# Altium project Freezer_Controller.PrjPcb (part 2 of 2)

## Sheet Power.SchDoc
size A3; SheetNumber: 9; SheetTotal: 9
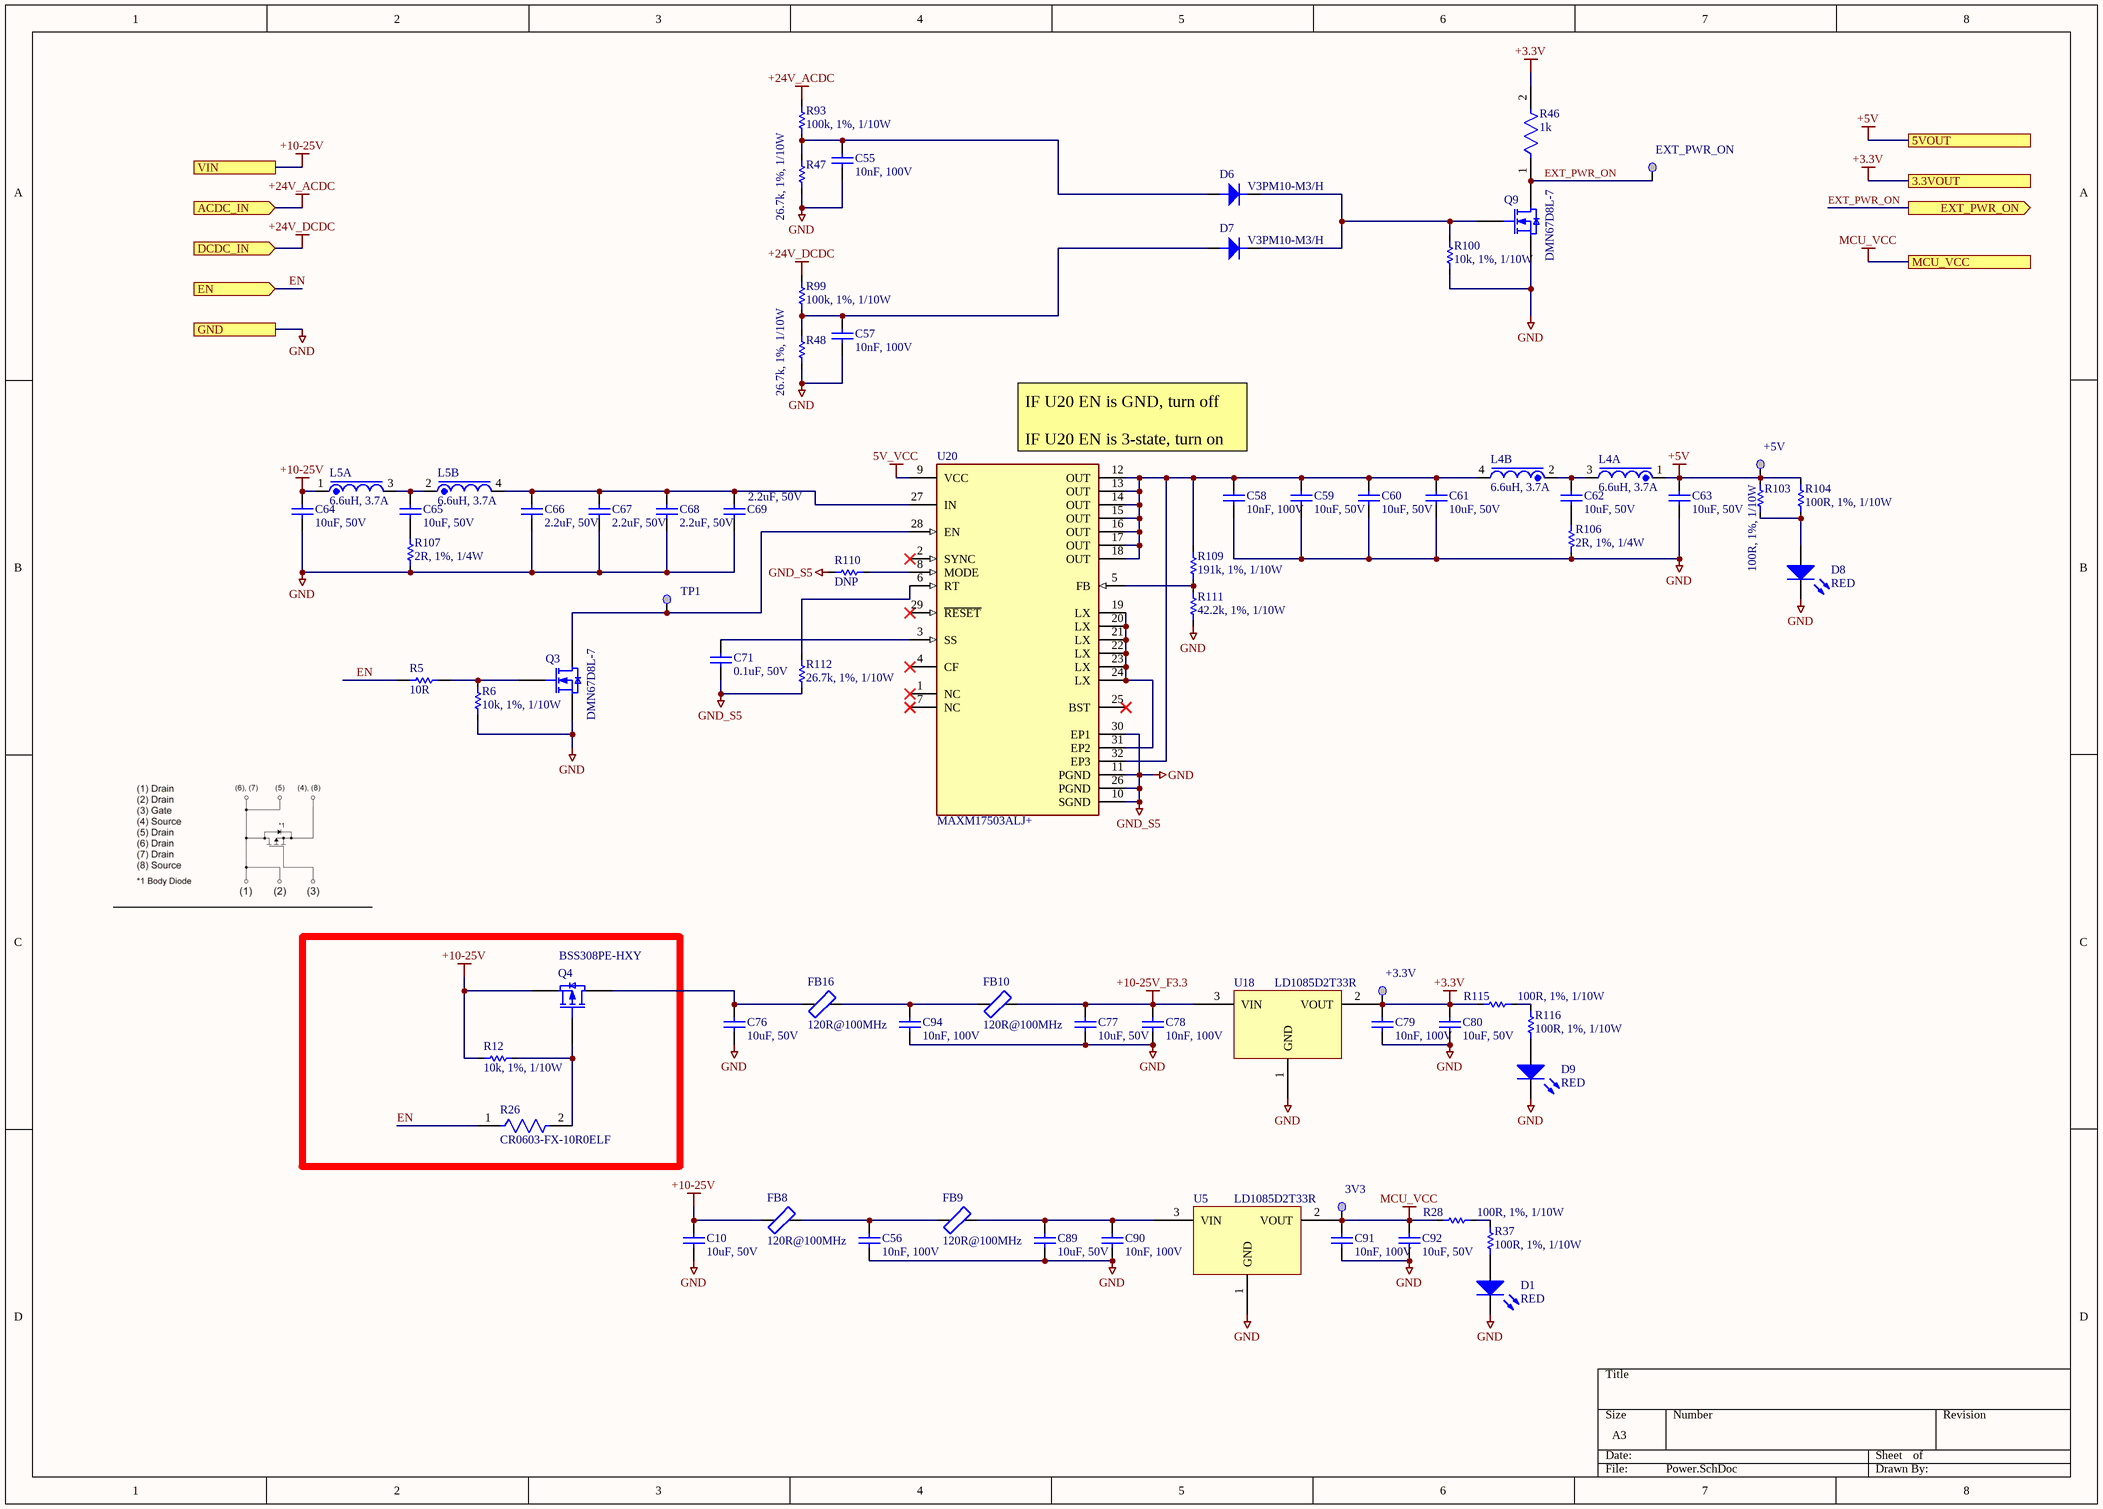
[diagram p3: Power.SchDoc]

### Parts
3V3  Test Point  [TEST POINT 40 Mil]  (value not drawn)  (no BOM)
+3.3V  Test Point  [TEST POINT 40 Mil]  (value not drawn)  (no BOM)
+5V  Test Point  [TEST POINT 40 Mil]  (value not drawn)  (no BOM)
C10  10uF, 50V  [1206]
C55  10nF, 100V  [0603]
C56  10nF, 100V  [0603]
C57  10nF, 100V  [0603]
C58  10nF, 100V  [0603]
C59  10uF, 50V  [1206]
C60  10uF, 50V  [1206]
C61  10uF, 50V  [1206]
C62  10uF, 50V  [1206]
C63  10uF, 50V  [1206]
C64  10uF, 50V  [1206]
C65  10uF, 50V  [1206]
C66  2.2uF, 50V  [1206]
C67  2.2uF, 50V  [1206]
C68  2.2uF, 50V  [1206]
C69  2.2uF, 50V  [1206]
C71  0.1uF, 50V  [0805]
C76  10uF, 50V  [1206]
C77  10uF, 50V  [1206]
C78  10nF, 100V  [0603]
C79  10nF, 100V  [0603]
C80  10uF, 50V  [1206]
C89  10uF, 50V  [1206]
C90  10nF, 100V  [0603]
C91  10nF, 100V  [0603]
C92  10uF, 50V  [1206]
C94  10nF, 100V  [0603]
D1  RED  [0603D]
D6  V3PM10-M3/H  [SMP]
D7  V3PM10-M3/H  [SMP]
D8  RED  [0603_DIODE_K1A2]
D9  RED  [0603_DIODE_K1A2]
EXT_PWR_ON  Test Point  [TEST POINT 40 Mil]  (value not drawn)  (no BOM)
FB8  120R@100MHz  [1206]
FB9  120R@100MHz  [1206]
FB10  120R@100MHz  [1206]
FB16  120R@100MHz  [1206]
L4  6.6uH, 3.7A  [PLCC300P1250X1250X600-4N]  (parts A,B of 2)
L5  6.6uH, 3.7A  [PLCC300P1250X1250X600-4N]  (parts A,B of 2)
Q3  DMN67D8L-7  [SOT23-3]
Q4  BSS308PE-HXY  [SOT-23]
Q9  DMN67D8L-7  [SOT23-3]
R5  10R  [RESC1608X55X25NL10T15]
R6  10k, 1%, 1/10W  [0603]
R12  10k, 1%, 1/10W  [0603]
R26  CR0603-FX-10R0ELF  [FP-CR0603-MFG]
R28  100R, 1%, 1/10W  [0603]
R37  100R, 1%, 1/10W  [0603]
R46  1k  [FP-MCT0603-MFG]
R47  26.7k, 1%, 1/10W  [0603]
R48  26.7k, 1%, 1/10W  [0603]
R93  100k, 1%, 1/10W  [0603]
R99  100k, 1%, 1/10W  [0603]
R100  10k, 1%, 1/10W  [0603]
R103  100R, 1%, 1/10W  [0603]
R104  100R, 1%, 1/10W  [0603]
R106  2R, 1%, 1/4W  [1206]
R107  2R, 1%, 1/4W  [1206]
R109  191k, 1%, 1/10W  [0603]
R110  DNP  [0603]
R111  42.2k, 1%, 1/10W  [0603]
R112  26.7k, 1%, 1/10W  [0603]
R115  100R, 1%, 1/10W  [0603]
R116  100R, 1%, 1/10W  [0603]
TP1  Test Point  [TEST POINT 40 Mil]  (value not drawn)  (no BOM)
U5  LD1085D2T33R  [D2PAK]
U18  LD1085D2T33R  [D2PAK]
U20  MAXM17503ALJ+  [FP-L32915-3-MFG]

### Ports
3.3VOUT, 5VOUT, ACDC_IN (in), DCDC_IN (in), EN (in), EXT_PWR_ON (out), GND, MCU_VCC, VIN

### Nets
5V_VCC: U20.9(VCC)
+3.3V: 3V3.1 +3.3V.1 C79.2 C80.2 C91.2 C92.2 R28.2 R46.2 R115.2 U5.2(VOUT) U18.2(VOUT) ; port 3.3VOUT, port MCU_VCC  [also labelled MCU_VCC]
+5V: +5V.1 C63.2 L4.1 R103.2 R104.2 ; port 5VOUT
+10-25V: C10.2 C64.2 FB8.1 L5.1 Q4.3(S) R12.1 ; port VIN
+10-25V_F3.3: C77.2 C78.2 FB10.2 U18.3(VIN)
+24V_ACDC: R93.1 ; port ACDC_IN  [project net ACDC_VS]
+24V_DCDC: R99.1 ; port DCDC_IN  [project net DCDC_VS]
GND: C10.1 C55.1 C56.1 C57.1 C58.1 C59.1 C60.1 C61.1 C63.1 C64.1 C66.1 C67.1 C68.1 C69.1 C71.1 C76.1 C77.1 C78.1 C79.1 C80.1 C89.1 C90.1 C91.1 C92.1 C94.1 D1.2(K) D8.2(K) D9.2(K) Q3.2(S) Q9.2(S) R6.2 R47.1 R48.1 R100.2 R106.1 R107.1 R110.1 R111.1 R112.1 U5.1(GND) U18.1(GND) U20.10(SGND) U20.11(PGND) U20.26(PGND) U20.30(EP1) ; port GND  [also labelled GND_S5]
EN: R5.1 R26.1 ; port EN
EXT_PWR_ON: EXT_PWR_ON.1 Q9.3(D) R46.1 ; port EXT_PWR_ON
NetC55_2: C55.2 D6.1(A) R47.2 R93.2
NetC56_2: C56.2 FB8.2 FB9.1
NetC57_2: C57.2 D7.1(A) R48.2 R99.2
NetC58_2: C58.2 C59.2 C60.2 C61.2 L4.4 R109.2 U20.12(OUT) U20.13(OUT) U20.14(OUT) U20.15(OUT) U20.16(OUT) U20.17(OUT) U20.18(OUT) U20.32(EP3)
NetC62_1: C62.1 R106.2
NetC62_2: C62.2 L4.2 L4.3
NetC65_1: C65.1 R107.2
NetC65_2: C65.2 L5.2 L5.3
NetC66_2: C66.2 C67.2 C68.2 C69.2 L5.4 U20.27(IN)
NetC71_2: C71.2 U20.3(SS)
NetC76_2: C76.2 FB16.1 Q4.2(D)
NetC89_2: C89.2 C90.2 FB9.2 U5.3(VIN)
NetC94_2: C94.2 FB10.1 FB16.2
NetD1_1: D1.1(A) R37.2
NetD6_2: D6.2(K) D7.2(K) Q9.1(G) R100.1
NetD8_1: D8.1(A) R103.1 R104.1
NetD9_1: D9.1(A) R116.2
NetQ3_1: Q3.1(G) R5.2 R6.1
NetQ3_3: Q3.3(D) TP1.1 U20.28(EN)
NetQ4_1: Q4.1(G) R12.2 R26.2
NetR28_1: R28.1 R37.1
NetR109_1: R109.1 R111.2 U20.5(FB)
NetR110_2: R110.2 U20.8(MODE)
NetR112_2: R112.2 U20.6(RT)
NetR115_1: R115.1 R116.1
NetU20_19: U20.19(LX) U20.20(LX) U20.21(LX) U20.22(LX) U20.23(LX) U20.24(LX) U20.31(EP2)

Not connected (* = marked no-connect by the designer): U20 1(NC)* 2(SYNC)* 4(CF)* 7(NC)* 25(BST)* 29(~{RESET})*

### Notes on the sheet
- IF U20 EN is GND, turn off
  IF U20 EN is 3-state, turn on

### Library data of the parts
3V3 +3.3V +5V EXT_PWR_ON TP1 = Test Point: Test Point 0.3mm; PartType: Mechanical; ComponentLink1Description: Datasheet
C10 C59-C65 C76 C77 C80 C89 C92 = NS00832: CAP CER 10UF 50V X7R 1206; Type: C; Alternatives: Generic; Part Number: NS00832; Value: 10uF, 50V; Supplier 1: Digi-Key; Supplier Part Number 1: 1276-6767-1-ND
C55-C58 C78 C79 C90 C91 C94 = NS00848: CAP CER 10000PF 100V C0G 0603; Type: C; Alternatives: Generic; Part Number: NS00848; Value: 10nF, 100V; Supplier 1: Digi-Key; Supplier Part Number 1: 445-172665-1-ND
C66-C69 = NS00824: CAP CER 2.2UF 50V X7R 1206; Type: C; Alternatives: Generic; Part Number: NS00824; Value: 2.2uF, 50V; Supplier 1: Digi-Key; Supplier Part Number 1: 1276-3137-1-ND
C71 = NS00353: 0.10µF ±10% 50V Ceramic Capacitor X7R 0805 (2012 Metric); Type: C; Alternatives: Generic; Part Number: NS00353; Value: 0.1uF, 50V; Supplier 1: Digi-Key; Supplier Part Number 1: 478-1395-1-ND
D1 D8 D9 = NS00945: LED RED CLEAR 1608 SMD; Type: IC; Part Number: NS00945; Value: RED; ComponentLink1Description: Datasheet; ComponentLink1URL: H:\Doc\Harvatek\B1911USD-20D000114U1930.pdf; Supplier 1: Digi-Key; Supplier Part Number 1: 3147-B1911USD-20D000114U1930CT-ND
D6 D7 = NS00857: SCHOTTKY RECTIFIER 3A 100V SMP; Part Number: NS00857; Type: Diode; Value: V3PM10-M3/H; ComponentLink1Description: Datasheet; ComponentLink1URL: H:\Doc\Vishay\v3pm10.pdf; Supplier 1: Digi-Key; Supplier Part Number 1: 112-V3PM10-M3/HCT-ND
FB8-FB10 FB16 = NS00883: FERRITE BEAD 120 OHM 1206 1LN; Type: Inductor; Part Number: NS00883; Value: 120R@100MHz; ComponentLink1Description: Datasheet; ComponentLink1URL: H:\Doc\Murata\QNFA9148.pdf; Supplier 1: Digi-Key; Supplier Part Number 1: 490-16523-1-ND
L4 L5 = NS00831: INDUCT ARRAY 2 COIL 6.6UH SMD; Type: Inductor; Part Number: NS00831; Value: 6.6uH, 3.7A; ComponentLink1Description: Datasheet; ComponentLink1URL: H:\Doc\pulse\SPM2007_28.pdf; Supplier 1: Digi-Key; Supplier Part Number 1: 553-3631-ND
Q3 Q9 = NS00873: MOSFET N-CH 60V 210MA SOT23; Type: IC; Published: 8-Jun-2000; LatestRevisionDate: 17-Jul-2002; LatestRevisionNote: Re-released for DXP Platform.; PackageVersion: 1995/1996; PackageReference: E3; Publisher: Altium Limited; Part Number: NS00873; Value: DMN67D8L-7; ComponentLink1Description: Datasheet; ComponentLink1URL: H:\Doc\Diodes\DMN67D8L.pdf; Supplier 1: Digi-Key; Supplier Part Number 1: DMN67D8L-7DICT-ND
Q4 = NS00810: P-CHANNEL MOSFET, / BSS308PE-HXY; Type: IC; Part Number: NS00810; Value: BSS308PE-HXY; ComponentLink1Description: Datasheet; ComponentLink1URL: H:\Doc\MicroCommercial\MCU45P03A(DPAK).pdf; Supplier 1: Digi-Key; Supplier Part Number 1: 353-MCU45P03A-TPCT-ND
R5 = CMP-1659-00008-4: Chip Resistor, 10 Ohm, +/- 1%, 0.1 W, -55 to 155 degC, 0603 (1608 Metric), RoHS, Tape and Reel; Manufacturer: Yageo; Voltage Rating: 50 V; PackageReference: 0603; ComponentLink3Description: Package Specification; Packaging: Tape and Reel; Max Operating Temperature: 155 degC; ComponentLink3URL: http://www.farnell.com/datasheets/443971.pdf; PackageDescription: 2-Pin Surface Mount Device, Body 1.6 x 0.8 mm; ComponentLink1URL: http://www.yageo.com/; Pins: 2; REACH SVHC: No SVHC; RoHSCompliant: true; ComponentLink2URL: http://www.yageo.com/documents/recent/PYu-RC_Group_51_RoHS_L_04.pdf; DatasheetVersion: Rev. 4, 02/2016; Mount: Surface Mount; Package Quantity: 200; Min Operating Temperature: -55 degC; Height: 0.45 mm; Mounting Technology: Surface Mount; ComponentLink1Description: Manufacturer URL; ComponentLink2Description: Datasheet; Length: 1.6 mm; Supplier 1: Digi-Key; Supplier Part Number 1: 311-10.0HRTR-ND
R6 R12 R100 = NS00820: RES 10K OHM 1% 1/10W 0603; Alternatives: Generic; Part Number: NS00820; Type: R; Value: 10k, 1%, 1/10W; Supplier 1: Digi-Key; Supplier Part Number 1: RMCF0603FT10K0CT-ND
R26 = CMP-1012-00284-2: Thick Film Chip Resistors 0603 10Ω 0.1W 1% 100ppm/°C; Max Power Dissipation: 100mW; Resistance: 10R; Voltage Rating: 50V; Depth: 0.8mm; REACH SVHC: No SVHC; Package Quantity: 1; Thickness: 457um; Length: 1.6mm; Tolerance: 1%; Width: 0.8mm; Number of Pins: 2; Height: 0.45mm; Military Standard: Not; Features: Moisture Resistant; Packaging: Tape and Reel; Case/Package: 0603; Power Rating: 100mW; Voltage Rating (DC): 50V; Radiation Hardening: No; Mount: Surface Mount; Min Operating Temperature: -55°C; Composition: Thick Film; Max Operating Temperature: 155°C; Termination: SMD/SMT; Temperature Coefficient: 100ppm/°C; Case Code (Imperial): 0603; Case Code (Metric): 1608; Number of Terminations: 2; Contact Plating: Tin
R28 R37 R103 R104 R115 R116 = NS00870: RES 100 OHM 1% 1/10W 0603; Alternatives: Generic; Part Number: NS00870; Type: R; Value: 100R, 1%, 1/10W; Supplier 1: Digi-Key; Supplier Part Number 1: RMCF0603FT100RCT-ND
R46 = CMP-02407-007689-1: RES SMD 1kOHM 1% 1/8W 0603; Power Rating: 125mW; Voltage Rating: 75V; Resistance: 150R; Temperature Coefficient: 25ppm/°C; Tolerance: 0.1%; Length: 0.061inch; Composition: Thin Film; Weight: 7.1E-05oz; Case Code (Imperial): 0603; Voltage Rating (DC): 75V; Termination: SMD/SMT; Max Power Dissipation: 125mW; Case Code (Metric): 1608; Package Quantity: 1; Height: 0.45mm; Radiation Hardening: No; Width: 0.033inch; Max Operating Temperature: 155°C; Case/Package: 0603; Features: Automotive AEC-Q200; Contact Plating: Tin; Packaging: Tape and Reel; Number of Pins: 2; Number of Terminations: 2; REACH SVHC: No SVHC; Depth: 0.85mm; Min Operating Temperature: -55°C; Supplier 1: Digi-Key; Supplier Part Number 1: 311-1.0KGRTR-ND
R47 R48 R112 = NS00823: RES 26.7K OHM 1% 1/10W 0603; Alternatives: Generic; Part Number: NS00823; Type: R; Value: 26.7k, 1%, 1/10W; Supplier 1: Digi-Key; Supplier Part Number 1: RMCF0603FT26K7
R93 R99 = NS00835: RES 100K OHM 1% 1/10W 0603; Alternatives: Generic; Part Number: NS00835; Type: R; Value: 100k, 1%, 1/10W; Supplier 1: Digi-Key; Supplier Part Number 1: RMCF0603FT100KCT-ND
R106 R107 = NS00946: RES 2 OHM 1% 1/4W 1206; Alternatives: Generic; Part Number: NS00946; Type: R; Value: 2R, 1%, 1/4W; Supplier 1: Digi-Key; Supplier Part Number 1: 738-RMCF1206FT2R00CT-ND
R109 = NS00821: RES 191K OHM 1% 1/10W 0603; Alternatives: Generic; Part Number: NS00821; Type: R; Value: 191k, 1%, 1/10W; Supplier 1: Digi-Key; Supplier Part Number 1: RMCF0603FT191KCT-ND
R110 = NS00876: RES 0 OHM JUMPER 1/10W 0603; Value: 0R, 1/10W; Alternatives: Generic; Part Number: NS00876; Type: R; Supplier 1: Digi-Key; Supplier Part Number 1: RMCF0603ZT0R00CT-ND
R111 = NS00822: RES 42.2K OHM 1% 1/10W 0603; Alternatives: Generic; Part Number: NS00822; Type: R; Value: 42.2k, 1%, 1/10W; Supplier 1: Digi-Key; Supplier Part Number 1: RMCF0603FT42K2
U5 U18 = NS00880: IC REG LINEAR 3.3V 3A D2PAK; Part Number: NS00880; Type: IC; Value: LD1085D2T33R; ComponentLink1Description: Datasheet; ComponentLink1URL: H:\Doc\ST\en.CD00001883.pdf; Supplier 1: Digi-Key; Supplier Part Number 1: 497-1222-1-ND
U20 = CMP-05722-000278-1: DC DC CONVERTER 0.9-12V; Output Voltage: 12V; Min Output Voltage: 900mV; Max Input Voltage: 60V; Number of Outputs: 1; Max Output Current: 2.5A; Min Input Voltage: 4.5V; Switching Frequency: 1.8MHz; Voltage - Output 1: 12V; Length: 0.59inch; Mount: Surface Mount; Max Operating Temperature: 125°C; Height: 0.11inch; Width: 0.35inch; Number of Pins: 29; Max Output Voltage: 12V; RoHS Compliant: Yes; Series: Himalaya; Min Operating Temperature: -40°C; Features: UVLO; Packaging: Rail/Tube; Output Current: 2.5A; Case/Package: SMD/SMT; Supplier 1: Digi-Key; Supplier Part Number 1: MAXM17503ALJ+-ND

## Sheet RTDIface.SchDoc
size A; SheetNumber: 7; SheetTotal: 10
Used 6 times, as channels U_RTDIface1, U_RTDIface2, U_RTDIface3, U_RTDIface4, U_RTDIface5, U_RTDIface6. Parts and nets are listed once, with the designators drawn on the sheet.
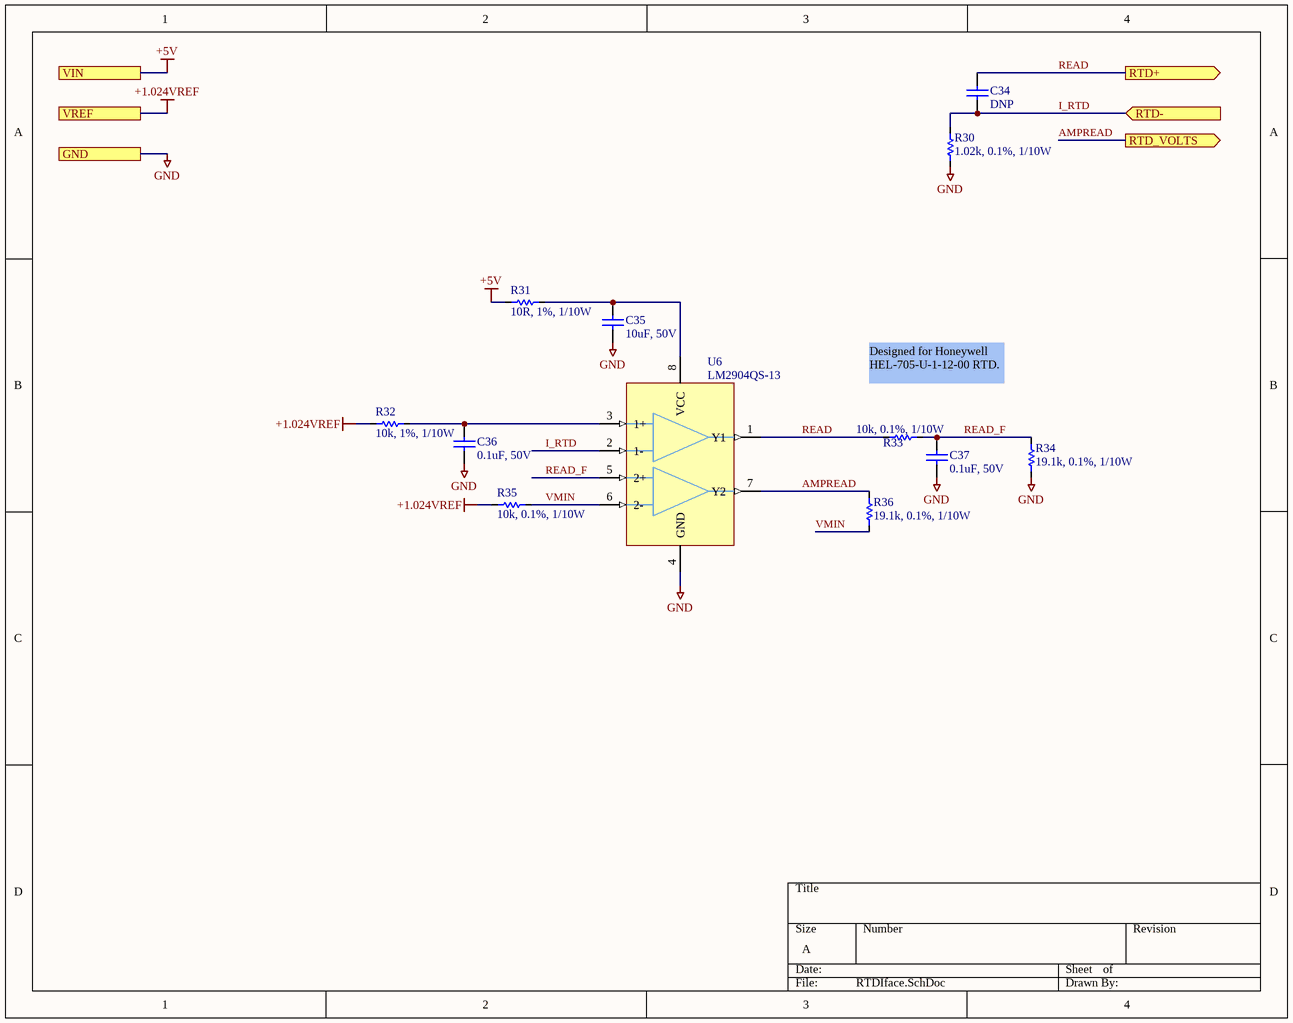
[diagram p4: RTDIface.SchDoc]

### Parts
C34  DNP  [0603]
C35  10uF, 50V  [1206]
C36  0.1uF, 50V  [0805]
C37  0.1uF, 50V  [0805]
R30  1.02k, 0.1%, 1/10W  [0603]
R31  10R, 1%, 1/10W  [0603]
R32  10k, 1%, 1/10W  [0603]
R33  10k, 0.1%, 1/10W  [0603]
R34  19.1k, 0.1%, 1/10W  [0603]
R35  10k, 0.1%, 1/10W  [0603]
R36  19.1k, 0.1%, 1/10W  [0603]
U6  LM2904QS-13  [SOIC127P600X163-8N]

### Ports
GND, RTD+ (out), RTD- (in), RTD_VOLTS (out), VIN, VREF

### Nets
+1.024VREF: R32.2 R35.1 ; port VREF
+5V: R31.1 ; port VIN
GND: C35.1 C36.1 C37.1 R30.1 R34.1 U6.4(GND) ; port GND
AMPREAD: R36.2 U6.7(Y2) ; port RTD_VOLTS
I_RTD: C34.2 R30.2 U6.2(1-) ; port RTD-
READ: C34.1 R33.1 U6.1(Y1) ; port RTD+
READ_F: C37.2 R33.2 R34.2 U6.5(2+)
VMIN: R35.2 R36.1 U6.6(2-)
NetC35_2: C35.2 R31.2 U6.8(VCC)
NetC36_2: C36.2 R32.1 U6.3(1+)

### Channels
U_RTDIface1: designators end in _1; ports GND=GND RTD+=READ RTD-=I_RTD RTD_VOLTS=AMPREAD VIN=+5V VREF=VREF
U_RTDIface2: designators end in _2; ports GND=GND RTD+=READ RTD-=I_RTD RTD_VOLTS=AMPREAD VIN=+5V VREF=VREF
U_RTDIface3: designators end in _3; ports GND=GND RTD+=READ RTD-=I_RTD RTD_VOLTS=AMPREAD VIN=+5V VREF=VREF
U_RTDIface4: designators end in _4; ports GND=GND RTD+=READ RTD-=I_RTD RTD_VOLTS=AMPREAD VIN=+5V VREF=VREF
U_RTDIface5: designators end in _5; ports GND=GND RTD+=READ RTD-=I_RTD RTD_VOLTS=AMPREAD VIN=+5V VREF=VREF
U_RTDIface6: designators end in _6; ports GND=GND RTD+=READ RTD-=I_RTD RTD_VOLTS=AMPREAD VIN=+5V VREF=VREF

### Notes on the sheet
- Designed for Honeywell HEL-705-U-1-12-00 RTD.

### Library data of the parts
C34 = NS00848: CAP CER 10000PF 100V C0G 0603; Type: C; Value: 10nF, 100V; Alternatives: Generic; Part Number: NS00848; Supplier 1: Digi-Key; Supplier Part Number 1: 445-172665-1-ND
C35 = NS00832: as C10 on sheet Power; Part Number: NS00832; Value: 10uF, 50V; Supplier 1: Digi-Key; Supplier Part Number 1: 1276-6767-1-ND
C36 C37 = NS00353: as C71 on sheet Power; Part Number: NS00353; Value: 0.1uF, 50V; Supplier 1: Digi-Key; Supplier Part Number 1: 478-1395-1-ND
R30 = NS00884: RES SMD 1.02KOHM 0.1% 1/10W 0603; Alternatives: Generic; Part Number: NS00884; Type: R; Value: 1.02k, 0.1%, 1/10W; Supplier 1: Digi-Key; Supplier Part Number 1: YAG2308CT-ND
R31 = NS00796: RES 10 OHM 1% 1/10W 0603; Alternatives: Generic; Part Number: NS00796; Type: R; Value: 10R, 1%, 1/10W; Supplier 1: Digi-Key; Supplier Part Number 1: 1292-WR06X10R0FTLCT-ND
R32 = NS00820: as R6 on sheet Power; Part Number: NS00820; Type: R; Value: 10k, 1%, 1/10W; Supplier 1: Digi-Key; Supplier Part Number 1: RMCF0603FT10K0CT-ND
R33 R35 = NS00885: RES SMD 10K OHM 0.1% 1/10W 0603; Alternatives: Generic; Part Number: NS00885; Type: R; Value: 10k, 0.1%, 1/10W; Supplier 1: Digi-Key; Supplier Part Number 1: YAG1236CT-ND
R34 R36 = NS00886: RES SMD 19.1KOHM 0.1% 1/10W 0603; Alternatives: Generic; Part Number: NS00886; Type: R; Value: 19.1k, 0.1%, 1/10W; Supplier 1: Digi-Key; Supplier Part Number 1: YAG1555CT-ND
U6 = NS00864: IC OPAMP GP 2 CIRCUIT 8SO; Part Number: NS00864; Type: IC; Value: LM2904QS-13; ComponentLink1Description: Datasheet; ComponentLink1URL: H:\Doc\Diodes\LM2902Q-04Q.pdf; Supplier 1: Digi-Key; Supplier Part Number 1: LM2904QS-13DICT-ND

## Sheet DisplayIface.SchDoc
size A; SheetNumber: 3; SheetTotal: 9
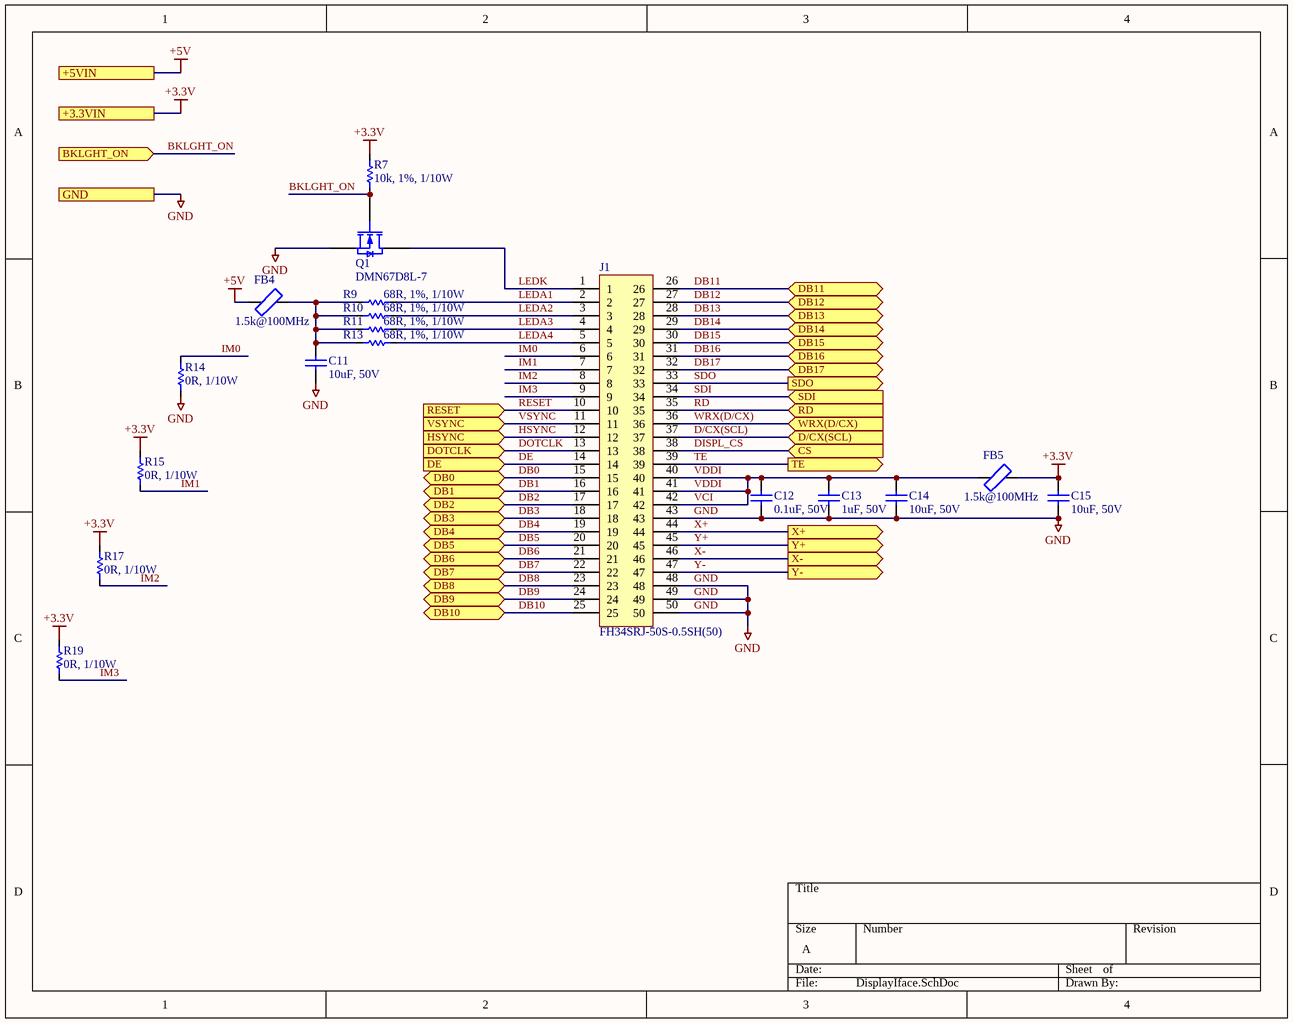
[diagram p5: DisplayIface.SchDoc]

### Parts
C11  10uF, 50V  [1206]
C12  0.1uF, 50V  [0805]
C13  1uF, 50V  [0805]
C14  10uF, 50V  [1206]
C15  10uF, 50V  [1206]
FB4  1.5k@100MHz  [0805]
FB5  1.5k@100MHz  [0805]
J1  FH34SRJ-50S-0.5SH(50)  [CONN_HIROSE_FH34SRJ-50S-0.5SH(50)]
Q1  DMN67D8L-7  [SOT23-3]
R7  10k, 1%, 1/10W  [0603]
R9  68R, 1%, 1/10W  [0603]
R10  68R, 1%, 1/10W  [0603]
R11  68R, 1%, 1/10W  [0603]
R13  68R, 1%, 1/10W  [0603]
R14  0R, 1/10W  [0603]
R15  0R, 1/10W  [0603]
R17  0R, 1/10W  [0603]
R19  0R, 1/10W  [0603]

### Ports
+3.3VIN, +5VIN, BKLGHT_ON (in), CS (in), D/CX(SCL) (in), DB0 (bidir), DB1 (bidir), DB2 (bidir), DB3 (bidir), DB4 (bidir), DB5 (bidir), DB6 (bidir), DB7 (bidir), DB8 (bidir), DB9 (bidir), DB10 (bidir), DB11 (bidir), DB12 (bidir), DB13 (bidir), DB14 (bidir), DB15 (bidir), DB16 (bidir), DB17 (bidir), DE (in), DOTCLK (in), GND, HSYNC (in), RD (in), RESET (in), SDI (in), SDO (out), TE (out), VSYNC (in), WRX(D/CX) (in), X+ (out), X- (out), Y+ (out), Y- (out)

### Nets
+3.3V: C15.2 FB5.1 R7.2 R15.2 R17.2 R19.2 ; port +3.3VIN
+5V: FB4.2 ; port +5VIN
GND: C11.1 C12.1 C13.1 C14.1 C15.1 J1.43 J1.48 J1.49 J1.50 Q1.2(S) R14.1 ; port GND
BKLGHT_ON: Q1.1(G) R7.1 ; port BKLGHT_ON
D/CX(SCL): J1.37 ; port D/CX(SCL)
DB0: J1.15 J1.16 J1.17 J1.18 J1.19 J1.20 J1.21 J1.22 J1.23 J1.24 J1.25 J1.26 J1.27 J1.28 J1.29 J1.30 J1.31 J1.32 ; port DB0, port DB1, port DB2, port DB3, port DB4, port DB5, port DB6, port DB7, port DB8, port DB9, port DB10, port DB11, port DB12, port DB13, port DB14, port DB15, port DB16, port DB17  [also labelled DB1, DB10, DB11, DB12, DB13, DB14, DB15, DB16, DB17, DB2, DB3, DB4, DB5, DB6, DB7, DB8, DB9]
DE: J1.11 J1.12 J1.13 J1.14 ; port VSYNC, port HSYNC, port DOTCLK, port DE  [also labelled DOTCLK, HSYNC, VSYNC]
DISPL_CS: J1.38 ; port CS
IM0: J1.6 R14.2
IM1: J1.7 R15.1
IM2: J1.8 R17.1
IM3: J1.9 R19.1
LEDA1: J1.2 R9.2
LEDA2: J1.3 R10.2
LEDA3: J1.4 R11.2
LEDA4: J1.5 R13.2
LEDK: J1.1 Q1.3(D)
RD: J1.35 ; port RD
RESET: J1.10 ; port RESET
SDI: J1.34 ; port SDI
SDO: J1.33 ; port SDO
TE: J1.39 ; port TE
VCI: C12.2 C13.2 C14.2 FB5.2 J1.40 J1.41 J1.42  [also labelled VDDI]
WRX(D/CX): J1.36 ; port WRX(D/CX)  [project net TFT_WRX]
X+: J1.44 ; port X+
X-: J1.46 ; port X-
Y+: J1.45 ; port Y+
Y-: J1.47 ; port Y-
NetC11_2: C11.2 FB4.1 R9.1 R10.1 R11.1 R13.1

### Library data of the parts
C11 C14 C15 = NS00832: as C10 on sheet Power; Part Number: NS00832; Value: 10uF, 50V; Supplier 1: Digi-Key; Supplier Part Number 1: 1276-6767-1-ND
C12 = NS00353: as C71 on sheet Power; Part Number: NS00353; Value: 0.1uF, 50V; Supplier 1: Digi-Key; Supplier Part Number 1: 478-1395-1-ND
C13 = NS00871: CAP CER 1UF 50V X7R 0805; Type: C; Alternatives: Generic; Part Number: NS00871; Value: 1uF, 50V; Supplier 1: Digi-Key; Supplier Part Number 1: 1276-6470-1-ND
FB4 FB5 = NS00881: WE-CBA SMT EMI SUPPRESSION FERRITE; Type: Inductor; Part Number: NS00881; Value: 1.5k@100MHz; ComponentLink1Description: Datasheet; ComponentLink1URL: H:\Doc\Wurth\782853162.pdf; Supplier 1: Digi-Key; Supplier Part Number 1: 732-782853162CT-ND
J1 = NS00813: CONN FFC 50 WAY; Part Number: NS00813; Type: Connector; Value: FH34SRJ-50S-0.5SH(50); ComponentLink1Description: Datasheet; ComponentLink1URL: H:\Doc\Hirose\FH34SRJ-50S-0.5SH(50)_CL0580-1266-2-50_SpecSheet_0000414509.pdf; ComponentLink2Description: Drawing; ComponentLink2URL: H:\Doc\Hirose\FH34SRJ-50S-0.5SH(50)_CL0580-1266-2-50_2DDrawing_0001483059.pdf; Supplier 1: Digi-Key; Supplier Part Number 1: FH34SRJ-50S-0.5SH(50)
Q1 = NS00873: MOSFET N-CH 60V 210MA SOT23; Type: IC; Published: 8-Jun-2000; LatestRevisionDate: 17-Jul-2002; LatestRevisionNote: Re-released for DXP Platform.; PackageVersion: 1995/1996; PackageReference: E3; Publisher: Altium Limited; Part Number: NS00873; Value: DMN67D8L-7; ComponentLink1Description: Datasheet; ComponentLink1URL: H:\Doc\Diodes\DMN67D8L.pdf; Supplier 1: Digi-Key; Supplier Part Number 1: DMN67D8L-7DICT-ND
R7 = NS00820: as R6 on sheet Power; Part Number: NS00820; Type: R; Value: 10k, 1%, 1/10W; Supplier 1: Digi-Key; Supplier Part Number 1: RMCF0603FT10K0CT-ND
R9-R11 R13 = NS00814: RES 68 OHM 1% 1/10W 0603; Alternatives: Generic; Part Number: NS00814; Type: R; Value: 68R, 1%, 1/10W; Supplier 1: Digi-Key; Supplier Part Number 1: 1292-WR06X68R0FTLCT-ND
R14 R15 R17 R19 = NS00876: RES 0 OHM JUMPER 1/10W 0603; Alternatives: Generic; Part Number: NS00876; Type: R; Value: 0R, 1/10W; Supplier 1: Digi-Key; Supplier Part Number 1: RMCF0603ZT0R00CT-ND

## Sheet USBIface.SchDoc
size A; SheetNumber: 7; SheetTotal: 9
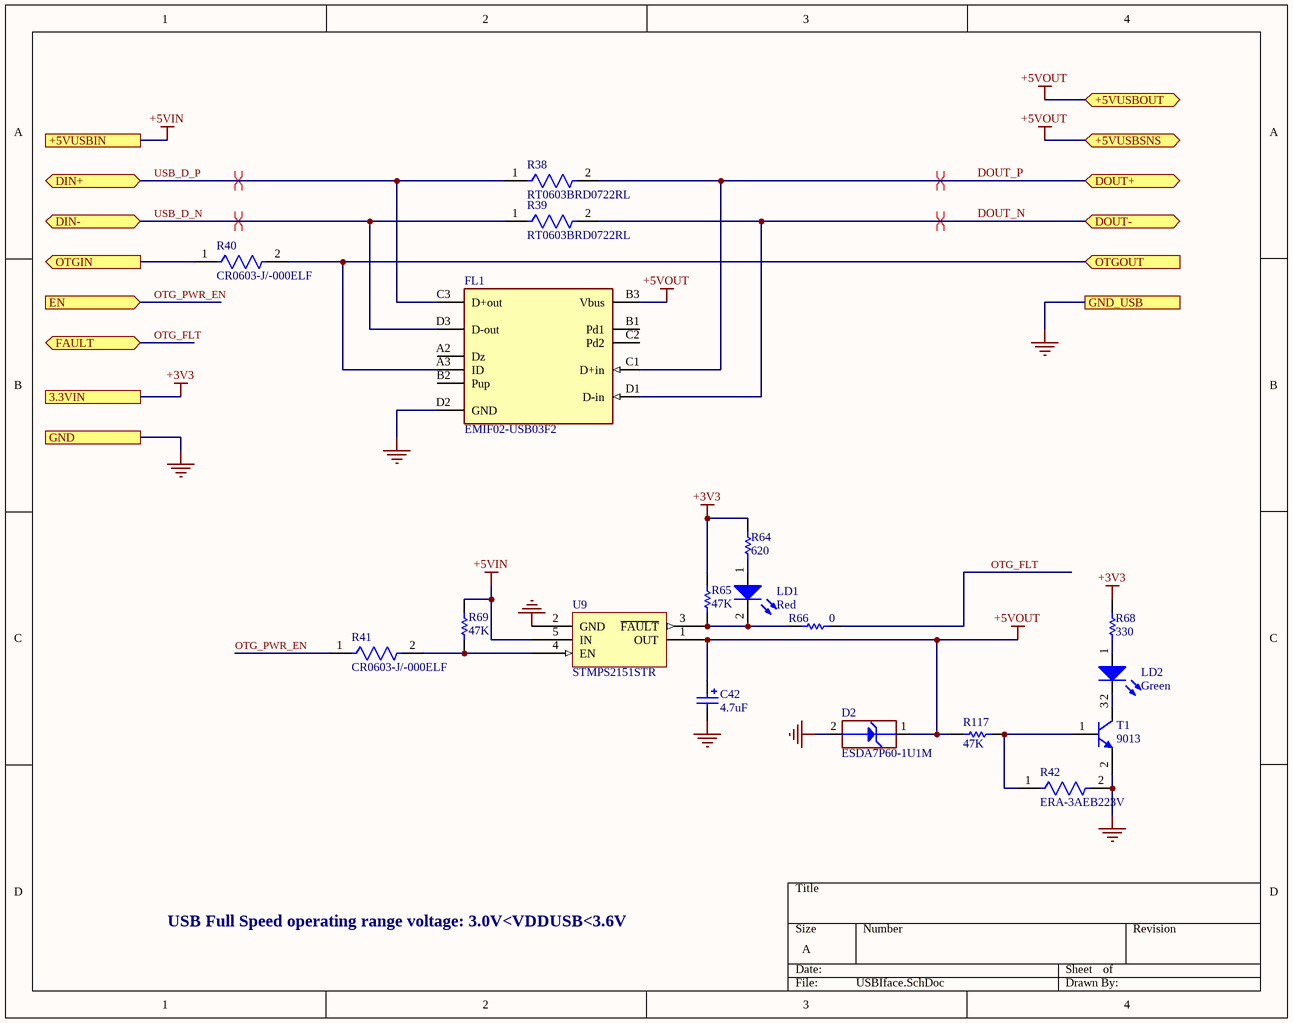
[diagram p6: USBIface.SchDoc]

### Parts
C42  4.7uF  [TAN-A]
D2  ESDA7P60-1U1M  [DO_2SM_1R6X1_21]
FL1  EMIF02-USB03F2  [FP-EMIF02-USB03F2-MFG]
LD1  Red  [0603D]
LD2  Green  [0603D]
R38  RT0603BRD0722RL  [FP-RT0603-MFG]
R39  RT0603BRD0722RL  [FP-RT0603-MFG]
R40  CR0603-J/-000ELF  [FP-CR0603-MFG]
R41  CR0603-J/-000ELF  [FP-CR0603-MFG]
R42  ERA-3AEB223V  [FP-ERA3A-MFG]
R64  620  [0603R]
R65  47K  [0603R]
R66  0  [0603R]
R68  330  [0603R]
R69  47K  [0603R]
R117  47K  [0603R]
T1  9013  [SOT-23]
U9  STMPS2151STR  [SOT23-5N]

### Ports
3.3VIN, +5VUSBIN, +5VUSBOUT (bidir), +5VUSBSNS (bidir), DIN+ (bidir), DIN- (bidir), DOUT+ (bidir), DOUT- (bidir), EN (in), FAULT (bidir), GND, GND_USB, OTGIN (out), OTGOUT (in)

### Nets
+3V3: R64.2 R65.1 R68.2 ; port 3.3VIN  [project net +3.3V]
+5VIN: R69.2 U9.5(IN) ; port +5VUSBIN  [project net +5V]
+5VOUT: C42.1 D2.1(IO1) FL1.B3(Vbus) R117.1 U9.1(OUT) ; port +5VUSBOUT, port +5VUSBSNS  [project net USB_VBUS]
GND: C42.2 D2.2(GND) FL1.D2(GND) R42.2 T1.2(E) U9.2(GND) ; port GND, port GND_USB
DOUT_N: FL1.D1(D-in) R39.2 ; port DOUT-
DOUT_P: FL1.C1(D+in) R38.2 ; port DOUT+
OTG_FLT: R66.1 ; port FAULT
OTG_PWR_EN: R41.1 ; port EN
OTGOUT: FL1.A3(ID) R40.2 ; port OTGOUT
USB_D_N: FL1.D3(D-out) R39.1 ; port DIN-
USB_D_P: FL1.C3(D+out) R38.1 ; port DIN+
USB_ID: R40.1 ; port OTGIN
NetLD1_1: LD1.1(A) R64.1
NetLD1_2: LD1.2(K) R65.2 R66.2 U9.3(~{FAULT})
NetLD2_1: LD2.1(A) R68.1
NetLD2_2: LD2.2(K) T1.3(C)
NetR41_2: R41.2 R69.1 U9.4(EN)
NetR42_1: R42.1 R117.2 T1.1(B)

Not connected (* = marked no-connect by the designer): FL1 A2(Dz) B1(Pd1) B2(Pup) C2(Pd2)

### Layout directives
differential pair: DOUT_N, DOUT_P, USB_D_N, USB_D_P

### Notes on the sheet
- USB Full Speed operating range voltage: 3.0V<VDDUSB<3.6V

### Library data of the parts
C42 = Cap Pol1: Polarized Capacitor (Radial); Value: 47uF; Published: 8-Jun-2000; Revision: July-2002: Re-released for DXP Platform.; Publisher: Altium Limited
D2 = MCD-00251: High power transient voltage suppressor, 7V breakdown; Manuf_1: STM; ECCN_US/EU: EAR99/NEC; Fitted: YES; Manuf_Part_1: ESDA7P60-1U1M; Ordered by: STM; Value: ESDA7P60-1U1M; Internal_Part_Number: MCD-00251; PartType: ICS; Manufacturer_Part_Number_1: ESDA7P60-1U1M; Manufacturer_1: STM; ComponentLink1URL: ST_ESDA7P60-1U1M.pdf; Provided_By: STM
FL1 = CMP-12082-000002-1: FILTER RC(PI) 33 OHM/20PF SMD; DC Resistance (DCR): 2R; ESD Protection: Yes; Number of Channels: 2; Tolerance: 5%; Series: EMIF; RoHS Compliant: Yes; Package Quantity: 5000; REACH SVHC: No SVHC; Termination: Flat; Width: 0.057inch; Length: 1.94mm; Min Operating Temperature: -40°C; Max Operating Temperature: 85°C; Lead Free: Lead Free; Depth: 1.57mm; Number of Pins: 11; Mount: Surface Mount; Height: 0.028inch; Packaging: Tape and Reel; Case/Package: FCBGA; Radiation Hardening: No
LD1 LD2 = LED2: Typical RED, GREEN, YELLOW, AMBER GaAs LED; Published: 8-Jun-2000; Revision: July-2002: Re-released for DXP Platform.; Publisher: Altium Limited
R38 R39 = CMP-03412-001872-1: RES SMD 22 OHM 0.1% 1/10W 0603; Manufacturer: Yageo; Resistance: 22Ω; Power Rating: 0.1W; Temperature Coefficient: 25 ppm/°C; Voltage Rating: 75V; Tolerance: 0.001; Value: 22Ω; Category: Res; Lead Free: Yes; Composition: Thin Film; ComponentLink2Description: Datasheet; Series: RT; Ipc Land Pattern Name: RESC16080X45; RoHS: TRUE; Manufacturer Part Number: RT0603BRD0722RL; Digikey Description: RES SMD 22 OHM 0.1% 1/10W 0603; Temperature: -55°C to +155°C; Temperature Range Low: -55°C; Device Class L3: Chip SMD Resistors; Package: RT0603; ComponentLink2URL: http://www.yageo.com/documents/recent/PYu-RT_1-to-0.01_RoHS_L_9.pdf; Automotive: No; Device Class L1: Passive Components; Octopart: https://octopart.com/rt0603brd0722rl-yageo-1422899; Device Class L2: Resistors; Mouser Description: Res SMD 22 Ohm 0.1% 1/10W 0603; Temperature Range High: +155°C; Footprint Url: http://www.yageo.com/exep/pages/download/literatures/PYu-R_Mount_10.pdf; Height: 0.55mm
R40 R41 = CMP-07231-000023-1: Thick Film Chip Resistors 0603 0Ω 0.1W 5%; Power Rating: 100mW; Resistance: 0mR; Voltage Rating (DC): 50V; Tolerance: 1%; Temperature Coefficient: 500ppm/°C; Depth: 0.8mm; Height: 0.45mm; Case Code (Metric): 1608; Number of Pins: 2; Max Operating Temperature: 155°C; Mount: Surface Mount; REACH SVHC: No SVHC; Radiation Hardening: No; Width: 0.8mm; Max Power Dissipation: 100mW; Thickness: 457um; Package Quantity: 5000; Composition: Thick Film; Case/Package: 0603; Military Standard: Not; Packaging: Tape and Reel; Voltage Rating: 50V; Case Code (Imperial): 0603; Min Operating Temperature: -55°C; Contact Plating: Tin; Length: 1.6mm; Termination: SMD/SMT
R42 = CMP-2000-00956-2: RES SMD 22K OHM 0.1% 1/10W 0603; Resistance: 22kR; Temperature Coefficient: 25ppm/°C; Voltage Rating (DC): 75V; Max Power Dissipation: 100mW; Mount: Surface Mount; Length: 1.6mm; Height: 0.45mm; Case/Package: 0603; Depth: 0.8mm; Number of Pins: 2; Width: 0.8mm; Resistance Tolerance: 0.1%; Construction: Rectangular; RoHS Compliant: Yes; Tolerance: 0.1%; Case Code (Metric): 1608; Power Rating: 100mW; Number of Terminations: 2; REACH SVHC: No SVHC; Radiation Hardening: No; Max Operating Temperature: 155°C; Lead Free: Lead Free; Resistor Type: Thin Film; Technology: THIN FILM; Termination: Solder; Packaging: Tape and Reel; Min Operating Temperature: -55°C; Contact Plating: Tin; Voltage Rating: 75V; Military Standard: Not; Series: ERA-3A; Package Quantity: 1; Size Code: 0603; Case Code (Imperial): 0603; Features: Automotive AEC-Q200
R64 R66 R69 = Res1: Resistor; Value: 1K; Published: 8-Jun-2000; Revision: July-2002: Re-released for DXP Platform.; Publisher: Altium Limited
R65 R68 R117 = res1: Resistor; Value: 1K; Published: 8-Jun-2000; Revision: July-2002: Re-released for DXP Platform.; Publisher: Altium Limited
T1 = NPN: NPN Bipolar Transistor; Code - JEDEC: TO-226-AA; Published: 8-Jun-2000; Revision: July-2002: Re-released for DXP Platform.; Publisher: Altium Limited
U9 = STMPS2141STR: Ordered by: STM

## Sheet Audio.SchDoc
size A; SheetNumber: 2; SheetTotal: 10
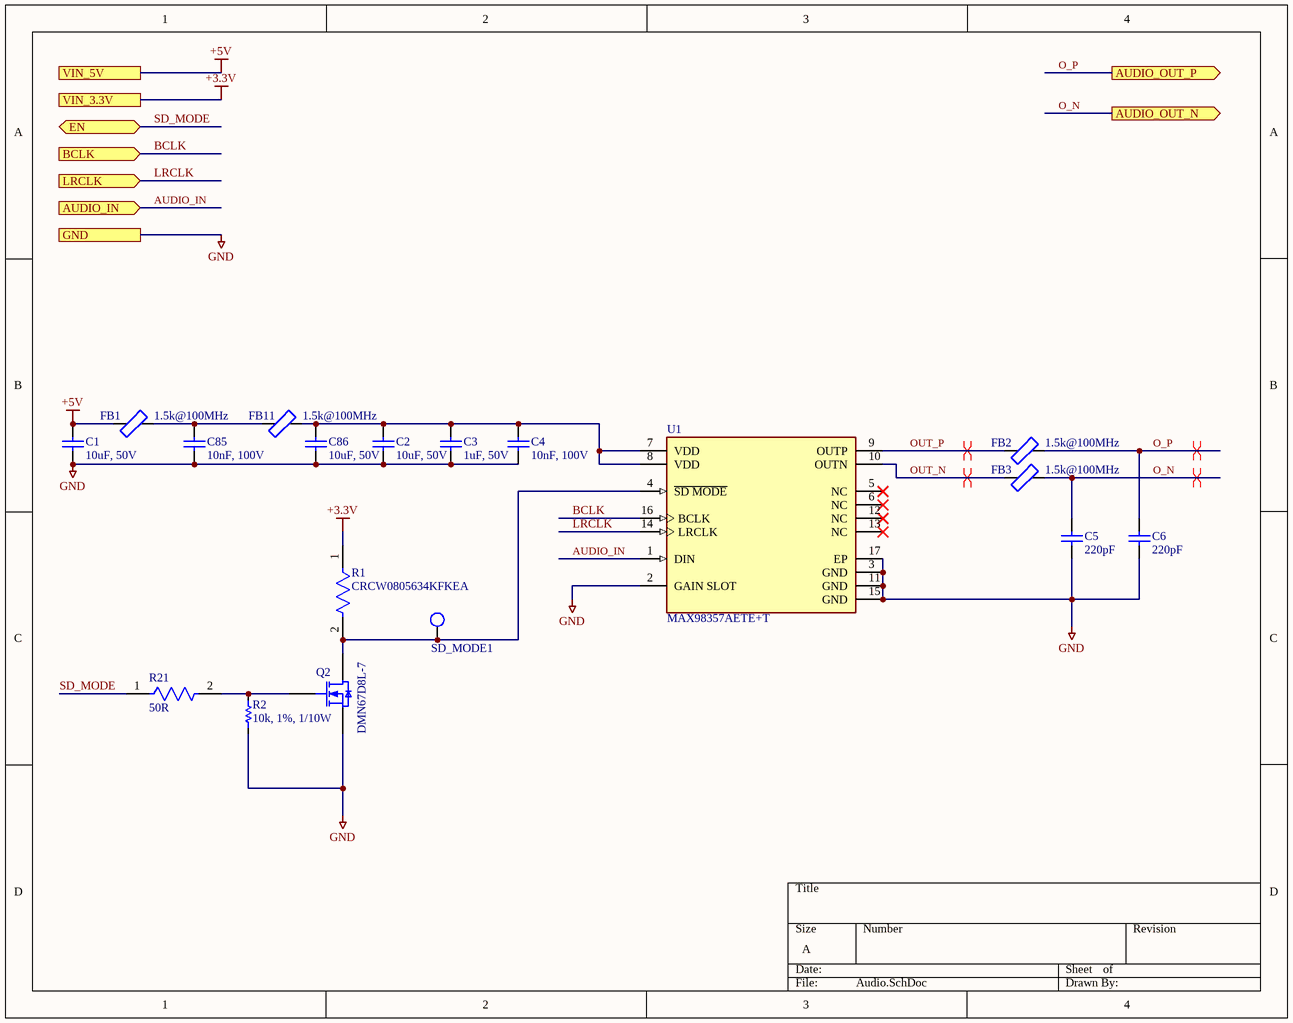
[diagram p7: Audio.SchDoc]

### Parts
C1  10uF, 50V  [1206]
C2  10uF, 50V  [1206]
C3  1uF, 50V  [0805]
C4  10nF, 100V  [0603]
C5  220pF  [CAPC2013X88X50LL20T25]
C6  220pF  [CAPC2013X88X50LL20T25]
C85  10nF, 100V  [0603]
C86  10uF, 50V  [1206]
FB1  1.5k@100MHz  [0805]
FB2  1.5k@100MHz  [0805]
FB3  1.5k@100MHz  [0805]
FB11  1.5k@100MHz  [0805]
Q2  DMN67D8L-7  [SOT23-3]
R1  CRCW0805634KFKEA  [FP-CRCW0805-e3-MFG]
R2  10k, 1%, 1/10W  [0603]
R21  50R  [FP-RCP0603W-MFG]
SD_MODE1  2mm  [TEST POINT 40 Mil]  (value not drawn)  (no BOM)
U1  MAX98357AETE+T  [FP-T1633-4-MFG]

### Ports
AUDIO_IN (in), AUDIO_OUT_N (out), AUDIO_OUT_P (out), BCLK (in), EN (bidir), GND, LRCLK (in), VIN_3.3V, VIN_5V

### Nets
+3.3V: R1.1 ; port VIN_3.3V
+5V: C1.2 FB1.1 ; port VIN_5V
GND: C1.1 C2.1 C3.1 C4.2 C5.1 C6.1 C85.2 C86.1 Q2.2(S) R2.2 U1.2(GAIN_SLOT) U1.3(GND) U1.11(GND) U1.15(GND) U1.17(EP) ; port GND
AUDIO_IN: U1.1(DIN) ; port AUDIO_IN
BCLK: U1.16(BCLK) ; port BCLK  [project net AUDIO_BCLK]
LRCLK: U1.14(LRCLK) ; port LRCLK  [project net AUDIO_LRCLK]
O_N: C5.2 FB3.2 ; port AUDIO_OUT_N
O_P: C6.2 FB2.2 ; port AUDIO_OUT_P
OUT_N: FB3.1 U1.10(OUTN)
OUT_P: FB2.1 U1.9(OUTP)
SD_MODE: R21.1 ; port EN  [project net AUDIO_EN]
NetC2_2: C2.2 C3.2 C4.1 C86.2 FB11.2 U1.7(VDD) U1.8(VDD)
NetC85_1: C85.1 FB1.2 FB11.1
NetQ2_1: Q2.1(G) R2.1 R21.2
NetQ2_3: Q2.3(D) R1.2 SD_MODE1.1(TP) U1.4(~{SD_MODE})

Not connected (* = marked no-connect by the designer): U1 5(NC)* 6(NC)* 12(NC)* 13(NC)*

### Layout directives
differential pair: O_N, O_P, OUT_N, OUT_P

### Library data of the parts
C1 C2 C86 = NS00832: as C10 on sheet Power; Part Number: NS00832; Value: 10uF, 50V; Supplier 1: Digi-Key; Supplier Part Number 1: 1276-6767-1-ND
C3 = NS00871: as C13 on sheet DisplayIface; Part Number: NS00871; Value: 1uF, 50V; Supplier 1: Digi-Key; Supplier Part Number 1: 1276-6470-1-ND
C4 C85 = NS00848: as C55 on sheet Power; Part Number: NS00848; Value: 10nF, 100V; Supplier 1: Digi-Key; Supplier Part Number 1: 445-172665-1-ND
C5 C6 = CMP-1036-02336-2: Part Number: C0805C221J2GACTU; Manufacturer: Kemet
FB1-FB3 FB11 = NS00881: as FB4 on sheet DisplayIface; Part Number: NS00881; Value: 1.5k@100MHz; ComponentLink1Description: Datasheet; ComponentLink1URL: H:\Doc\Wurth\782853162.pdf; Supplier 1: Digi-Key; Supplier Part Number 1: 732-782853162CT-ND
Q2 = NS00873: MOSFET N-CH 60V 210MA SOT23; Type: IC; Published: 8-Jun-2000; LatestRevisionDate: 17-Jul-2002; LatestRevisionNote: Re-released for DXP Platform.; PackageVersion: 1995/1996; PackageReference: E3; Publisher: Altium Limited; Part Number: NS00873; Value: DMN67D8L-7; ComponentLink1Description: Datasheet; ComponentLink1URL: H:\Doc\Diodes\DMN67D8L.pdf; Supplier 1: Digi-Key; Supplier Part Number 1: DMN67D8L-7DICT-ND
R1 = CMP-1013-00827-2: RES Thick Film, 634kΩ, 1%, 0.125W, 100ppm/°C, 0805; Voltage Rating: 150V; Max Power Dissipation: 125mW; Resistance: 634kR; Weight: 0.000194oz; Max Operating Temperature: 155°C; Case Code (Metric): 2012; Height: 0.02inch; Temperature Coefficient: 100ppm/°C; Power Rating: 125mW; Length: 2mm; Contact Plating: Tin; Package Quantity: 10; Packaging: Tape and Reel; Min Operating Temperature: -55°C; Case Code (Imperial): 0805; Termination: SMD/SMT; Composition: Thick Film; Case/Package: 0805; Lead Free: Lead Free; Voltage Rating (DC): 150V; Width: 0.049inch; Features: Automotive AEC-Q200; Tolerance: 1%; Radiation Hardening: No; Depth: 1.25mm; Military Standard: Not; Number of Terminations: 2; Supplier 1: Digi-Key; Supplier Part Number 1: CRCW0805634KFKEA
R2 = NS00820: as R6 on sheet Power; Part Number: NS00820; Type: R; Value: 10k, 1%, 1/10W; Supplier 1: Digi-Key; Supplier Part Number 1: RMCF0603FT10K0CT-ND
R21 = CMP-02407-013160-1: RES SMD 50 OHM 2% 1.5W 0603; Max Power Dissipation: 3.9W; Temperature Coefficient: 150ppm/°C; Resistor Type: Thick Film; Case Code (Imperial): 0603; Technology: THICK FILM; Termination: Solder; Width: 0.032inch; Resistance: 50R; Number of Terminations: 2; Mount: Surface Mount; Features: Moisture Resistant; Series: RCP; Depth: 0.81mm; Case/Package: 0603; Max Operating Temperature: 155°C; Power Rating: 3.9W; Min Operating Temperature: -55°C; Case Code (Metric): 1608; Height: 0.023inch; Length: 0.063inch; Tolerance: 2%; Packaging: Cut Tape
SD_MODE1 = NS00254: Testpoint 2mm round; Part Number: NS00254; Type: Mechanical; Value: 2mm
U1 = CMP-05698-000018-1: IC AMP CLASS D MONO 3.2W 16TQFN; Max Supply Voltage: 5.5V; Max Output Current: 1.6A; Voltage Gain: 15dB; Max Power Dissipation: 1.666W; Min Supply Voltage: 2.5V; Power Supply Rejection Ratio (PSRR): 77dB; Series: -; Contact Plating: Tin; Min Operating Temperature: -40°C; Packaging: Tape and Reel; Max Output Power: 3.2W; Mount: Surface Mount; Number of Pins: 16; RoHS Compliant: Yes; Max Operating Temperature: 85°C; Radiation Hardening: No

## Sheet FLASH.SchDoc
size A; SheetNumber: 4; SheetTotal: 9
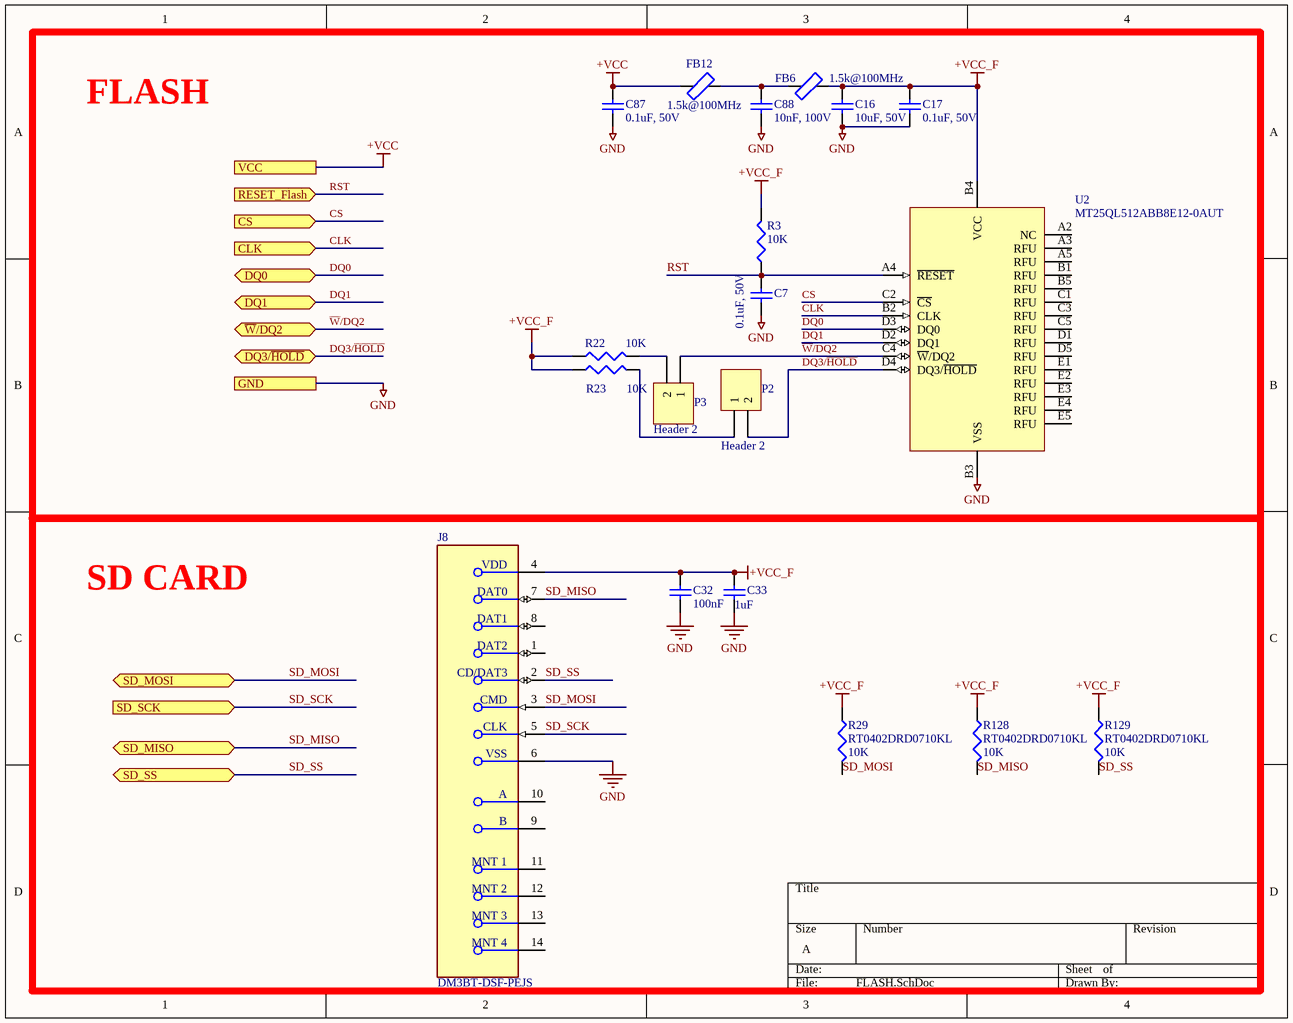
[diagram p8: FLASH.SchDoc]

### Parts
C7  0.1uF, 50V  [0805]
C16  10uF, 50V  [1206]
C17  0.1uF, 50V  [0805]
C32  100nF  [CAPC1005X55X30LL05T10]
C33  value 1uF  [C1206]  (hidden comment: C1206C105K4RACTU)
C87  0.1uF, 50V  [0805]
C88  10nF, 100V  [0603]
FB6  1.5k@100MHz  [0805]
FB12  1.5k@100MHz  [0805]
J8  DM3BT-DSF-PEJS  [FP-DM3BT-DSF-PEJS-MFG]
P2  Header 2  [HDR1X2]
P3  Header 2  [HDR1X2]
R3  value 10K  [0603]  (hidden comment: RT0603DRD0710KL)
R22  value 10K  [J1-0603]  (hidden comment: RT0603DRD0710KL)
R23  value 10K  [J1-0603]  (hidden comment: RT0603DRD0710KL)
R29  RT0402DRD0710KL  value 10K  [0402]
R128  RT0402DRD0710KL  value 10K  [0402]
R129  RT0402DRD0710KL  value 10K  [0402]
U2  MT25QL512ABB8E12-0AUT  [BGA24C100P5X5_600X800X120]

### Blocks framed on the sheet
FLASH: C7 C16 C17 C87 C88 FB6 FB12 P2 P3 R3 R22 R23 U2
SD CARD: C32 C33 J8 R29 R128 R129

### Ports
CLK (in), CS (in), DQ0 (bidir), DQ1 (bidir), DQ3/~{HOLD} (bidir), GND, RESET_Flash (in), SD_MISO (bidir), SD_MOSI (bidir), SD_SCK (in), SD_SS (bidir), VCC, ~{W}/DQ2 (bidir)

### Nets
+VCC: C87.2 FB12.2 ; port VCC  [project net +3.3V]
+VCC_F: C16.2 C17.2 C32.2 C33.2 FB6.2 J8.4(VDD) R3.2 R22.1 R23.1 R29.1 R128.1 R129.1 U2.B4(VCC)
GND: C7.1 C16.1 C17.1 C32.1 C33.1 C87.1 C88.2 J8.6(VSS) U2.B3(VSS) ; port GND
CLK: U2.B2(CLK) ; port CLK
CS: U2.C2(~{CS}) ; port CS
DQ0: U2.D3(DQ0) ; port DQ0
DQ1: U2.D2(DQ1) ; port DQ1
DQ3/~{HOLD}: P2.2 U2.D4(DQ3/~{HOLD}) ; port DQ3/~{HOLD}
RST: C7.2 R3.1 U2.A4(~{RESET}) ; port RESET_Flash  [project net ~{FLASH_RST}]
SD_MISO: J8.7(DAT0) R128.2 ; port SD_MISO
SD_MOSI: J8.3(CMD) R29.2 ; port SD_MOSI
SD_SCK: J8.5(CLK) ; port SD_SCK
SD_SS: J8.2(CD/DAT3) R129.2 ; port SD_SS
~{W}/DQ2: P3.1 U2.C4(~{W}/DQ2) ; port ~{W}/DQ2  [project net FLASH_D2]
NetC88_1: C88.1 FB6.1 FB12.1
NetP2_1: P2.1 R23.2
NetP3_2: P3.2 R22.2

Not connected (* = marked no-connect by the designer): J8 1(DAT2) 8(DAT1) 9(B) 10(A) 11(MNT_1) 12(MNT_2) 13(MNT_3) 14(MNT_4); U2 A2(NC) A3(RFU) A5(RFU) B1(RFU) B5(RFU) C1(RFU) C3(RFU) C5(RFU) D1(RFU) D5(RFU) E1(RFU) E2(RFU) E3(RFU) E4(RFU) E5(RFU)

### Library data of the parts
C7 C17 C87 = NS00353: as C71 on sheet Power; Part Number: NS00353; Value: 0.1uF, 50V; Supplier 1: Digi-Key; Supplier Part Number 1: 478-1395-1-ND
C16 = NS00832: as C10 on sheet Power; Part Number: NS00832; Value: 10uF, 50V; Supplier 1: Digi-Key; Supplier Part Number 1: 1276-6767-1-ND
C32 = CMP-0001-00074-2: Suuplier 1: Digi-Key; Supplier Part Number 1: 399-C0402C104K4RAC7867TR-ND
C33 = Cap Semi: Capacitor (Semiconductor SIM Model); Published: 8-Jun-2000; LatestRevisionDate: 29-May-2009; LatestRevisionNote: IPC-7351 Footprint Added.; PackageReference: C1206; Publisher: Altium Limited; PackageDescription: Chip Capacitor; Supplier 1: Digi-Key; Supplier Part Number 1: 399-C1206C105K4RAC7800TR-ND
C88 = NS00848: as C55 on sheet Power; Part Number: NS00848; Value: 10nF, 100V; Supplier 1: Digi-Key; Supplier Part Number 1: 445-172665-1-ND
FB6 FB12 = NS00881: as FB4 on sheet DisplayIface; Part Number: NS00881; Value: 1.5k@100MHz; ComponentLink1Description: Datasheet; ComponentLink1URL: H:\Doc\Wurth\782853162.pdf; Supplier 1: Digi-Key; Supplier Part Number 1: 732-782853162CT-ND
J8 = CMP-11597-000004-1: CONN MICRO SD CARD PUSH-PUSH R/A; Connector Type: Connector; Pitch: 1.1mm; Insulation Resistance: 1GR; Contact Resistance: 100mR; Number of Positions: 8; Max Voltage Rating (AC): 125V; Gender: Female; Current Rating: 500mA; Flammability Rating: UL94 V-0; Min Operating Temperature: -25°C; Lead Free: Lead Free; Length: 13.85mm; Radiation Hardening: No; Orientation: Right Angle; Mount: Surface Mount; Housing Material: Polymer; Contact Material: Copper Alloy; Package Quantity: 1; Contact Plating: Gold; Termination: Solder; Max Operating Temperature: 85°C; Number of Contacts: 8; Voltage Rating (AC): 125V; REACH SVHC: No SVHC; Depth: 1.83mm; Max Current Rating: 500mA; Width: 16.05mm; Number of Rows: 1; Packaging: Tape and Reel; Supplier 1: Digi-Key; Supplier Part Number 1: HR1942TR-ND
P2 P3 = Header 2: Header, 2-Pin; LatestRevisionDate: 17-Jul-2002; LatestRevisionNote: Re-released for DXP Platform.; Publisher: Altium Limited
R3 R22 R23 R29 R128 R129 = Res3: Resistor; Published: 8-Jun-2000; LatestRevisionDate: 29-May-2009; LatestRevisionNote: IPC-7351 Footprint Added.; PackageReference: J1-0603; Publisher: Altium Limited; PackageDescription: Chip Resistor; Supplier 1: Digi-Key
  R3 R22 R23: Supplier Part Number 1: 311-10KDTR-ND
  R29 R128 R129: Supplier Part Number 1: 311-2131-2-ND
U2 = NS00922: IC FLASH 512MBIT SPI 24TPBGA; Part Number: NS00922; Type: IC; Value: MT25QL512ABB8E12-0AUT; ComponentLink1Description: Datasheet; ComponentLink1URL: H:\Doc\Micron\mt25q_qlkt_l_512_abb_0.pdf; Supplier 1: Digi-Key; Supplier Part Number 1: MT25QL512ABB8E12-0AUT-ND

## Sheet RTC.SchDoc
size A; SheetNumber: 8; SheetTotal: 9
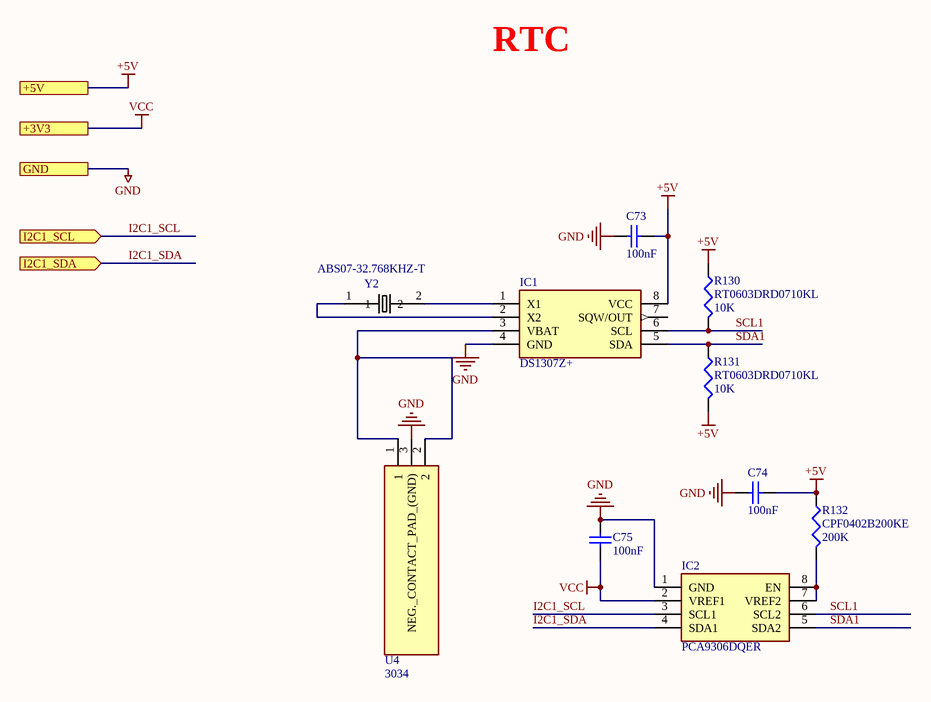
[diagram p9: RTC.SchDoc]

### Parts
C73  100nF  [CAPC1005X55X30LL05T10]
C74  100nF  [CAPC1005X55X30LL05T10]
C75  100nF  [CAPC1005X55X30LL05T10]
IC1  DS1307Z+  [S8-2_M]
IC2  PCA9306DQER  [FP-DQE0008A-MFG]
R130  RT0603DRD0710KL  value 10K  [J1-0603]
R131  RT0603DRD0710KL  value 10K  [J1-0603]
R132  CPF0402B200KE  value 200K  [0402]
U4  3034  [FP-3034-MFG]
Y2  ABS07-32.768KHZ-T  [FP-ABS07-MFG]

### Ports
+3V3, +5V, GND, I2C1_SCL (in), I2C1_SDA (in)

### Nets
+5V: C73.1 C74.1 IC1.8(VCC) R130.1 R131.2 R132.1 ; port +5V
GND: C73.2 C74.2 C75.2 IC1.4(GND) IC2.1(GND) U4.3(NEG._CONTACT_PAD_(GND)) ; port GND
VCC: C75.1 IC2.2(VREF1) ; port +3V3  [project net +3.3V]
I2C1_SCL: IC2.3(SCL1) ; port I2C1_SCL
I2C1_SDA: IC2.4(SDA1) ; port I2C1_SDA
SCL1: IC1.6(SCL) IC2.6(SCL2) R130.2
SDA1: IC1.5(SDA) IC2.5(SDA2) R131.1
NetIC1_1: IC1.1(X1) Y2.2
NetIC1_2: IC1.2(X2) Y2.1
NetIC1_3: IC1.3(VBAT) U4.1 U4.2
NetIC2_7: IC2.7(VREF2) IC2.8(EN) R132.2

Not connected (* = marked no-connect by the designer): IC1 7(SQW/OUT)

### Notes on the sheet
- RTC

### Library data of the parts
C73-C75 = CMP-0001-00074-2: Suuplier 1: Digi-Key; Supplier Part Number 1: 399-C0402C104K4RAC7867TR-ND
IC1 = DS1307Z+: Integrated Circuit; Manufacturer_Name: Maxim Integrated; Datasheet Link: http://datasheets.maximintegrated.com/en/ds/DS1307.pdf; Height: 1.75mm; Manufacturer_Part_Number: DS1307Z+; Mouser Part Number: 700-DS1307Z; Mouser Price/Stock: https://www.mouser.com/Search/Refine.aspx?Keyword=700-DS1307Z; RS Part Number: 1698316; RS Price/Stock: http://uk.rs-online.com/web/p/products/1698316; Supplier 1: Digi-Key; Supplier Part Number 1: DS1307Z+-ND
IC2 = PCA9306DQER: Integrated Circuit; Manufacturer_Name: Texas Instruments; Datasheet Link: http://www.ti.com/lit/ds/symlink/pca9306.pdf; Height: 0.4mm; Manufacturer_Part_Number: PCA9306DQER; Arrow Part Number: PCA9306DQER; Arrow Price/Stock: https://www.arrow.com/en/products/pca9306dqer/texas-instruments; Mouser Part Number: 595-PCA9306DQER; Mouser Price/Stock: https://www.mouser.co.uk/ProductDetail/Texas-Instruments/PCA9306DQER?qs=g5raLcSarOb3s8X2FUFJYw%3D%3D; Supplier 1: Digi-Key; Supplier Part Number 1: 296-27957-2-ND
R130-R132 = Res3: Resistor; Published: 8-Jun-2000; LatestRevisionDate: 29-May-2009; LatestRevisionNote: IPC-7351 Footprint Added.; PackageReference: J1-0603; Publisher: Altium Limited; PackageDescription: Chip Resistor; Supplier 1: Digi-Key
  R130 R131: Supplier Part Number 1: 311-10KDTR-ND
  R132: Supplier Part Number 1: A119933TR-ND
U4 = 3034: CR2032 COINCELL 3V BATTERY Holder; Manufacturer_Name: Keystone Electronics; Datasheet Link: http://www.keyelco.com/product-pdf.cfm?p=798; Height: 4.06mm; Manufacturer_Part_Number: 3034; Arrow Part Number: 3034; Arrow Price/Stock: https://www.arrow.com/en/products/3034/keystone-electronics; Mouser Part Number: 534-3034; Mouser Price/Stock: https://www.mouser.co.uk/ProductDetail/Keystone-Electronics/3034?qs=LDXARy4xNQtGYr6pIAv90A%3D%3D; Supplier 1: Digi-Key; Supplier Part Number 1: 36-3034-ND
Y2 = ABS07-32.768KHZ-T: ABS07 Series 32.768 kHz Â±20 ppm 12.5 pF -40 to +85 Â°C SMT Low Profile Crystal; MF: Abracon; Package: SMD-2 Abracon; MP: ABS07-32.768KHZ-T; Availability: Good; Price: 0.54 USD; Value: *; Supplier 1: Digi-Key; Supplier Part Number 1: 535-9542-2-ND

## Nets that join several sheets
+3.3V: TopLevel (5 pins), Micro (25 pins), Power (11 pins), DisplayIface (6 pins), USBIface (R64.2 R65.1 R68.2), Audio (R1.1), FLASH (C87.2 FB12.2), RTC (C75.1 IC2.2)
+5V: TopLevel (9 pins), Power (5 pins), U_RTDIface1 (R31_1.1), U_RTDIface2 (R31_2.1), U_RTDIface3 (R31_3.1), U_RTDIface4 (R31_4.1), U_RTDIface5 (R31_5.1), U_RTDIface6 (R31_6.1), DisplayIface (FB4.2), USBIface (R69.2 U9.5), Audio (C1.2 FB1.1), RTC (6 pins)
+10-25V: TopLevel (C49.1 C51.2 L3.1), Power (6 pins)
ACDC_VS: TopLevel (J3.4 R118.1), Power (R93.1)
DCDC_VS: TopLevel (J3.3 R120.1), Power (R99.1)
GND: TopLevel (41 pins), Micro (29 pins), Power (45 pins), U_RTDIface1 (6 pins), U_RTDIface2 (6 pins), U_RTDIface3 (6 pins), U_RTDIface4 (6 pins), U_RTDIface5 (6 pins), U_RTDIface6 (6 pins), DisplayIface (11 pins), USBIface (6 pins), Audio (15 pins), FLASH (9 pins), RTC (6 pins)
USB_VBUS: TopLevel (J6.1), Micro (U3.68), USBIface (5 pins)
VREF: TopLevel (8 pins), U_RTDIface1 (R32_1.2 R35_1.1), U_RTDIface2 (R32_2.2 R35_2.1), U_RTDIface3 (R32_3.2 R35_3.1), U_RTDIface4 (R32_4.2 R35_4.1), U_RTDIface5 (R32_5.2 R35_5.1), U_RTDIface6 (R32_6.2 R35_6.1)
~{FLASH_RST}: Micro (U3.43), FLASH (C7.2 R3.1 U2.A4)
ACDC_VS_3.3: TopLevel (C81.2 R118.2 R119.2), Micro (U3.84)
AMPREAD: TopLevel (C38.1 R83.1), U_RTDIface1 (R36_1.2 U6_1.7)
AMPREAD: TopLevel (C39.1 R84.1), U_RTDIface2 (R36_2.2 U6_2.7)
AMPREAD: TopLevel (C40.1 R85.1), U_RTDIface3 (R36_3.2 U6_3.7)
AMPREAD: TopLevel (C41.1 R86.1), U_RTDIface4 (R36_4.2 U6_4.7)
AMPREAD: TopLevel (C43.1 R87.1), U_RTDIface5 (R36_5.2 U6_5.7)
AMPREAD: TopLevel (C44.1 R88.1), U_RTDIface6 (R36_6.2 U6_6.7)
AUDIO_BCLK: Micro (U3.4), Audio (U1.16)
AUDIO_EN: Micro (U3.2), Audio (R21.1)
AUDIO_IN: Micro (U3.5), Audio (U1.1)
AUDIO_LRCLK: Micro (U3.3), Audio (U1.14)
BKLGHT_ON: TopLevel (TP20.1), Micro (U3.65), DisplayIface (Q1.1 R7.1)
BTN1_D: TopLevel (R45.2), Micro (U3.40)
BTN2_R: TopLevel (R80.2), Micro (U3.41)
BTN3_R: TopLevel (R81.2), Micro (U3.39)
Buzzer: TopLevel (R71.1), Micro (U3.30)
CHRG_OK: TopLevel (J2.2), Micro (U3.61)
CLK: Micro (U3.47), FLASH (U2.B2)
CMPRSR_D: TopLevel (J2.6), Micro (U3.60)
CMPRSR_EN: TopLevel (J2.5), Micro (U3.57)
CMPRSR_FAN: TopLevel (J2.7), Micro (U3.59)
CMPRSR_SPD: TopLevel (L8.2), Micro (U3.56)
CS: Micro (U3.42), FLASH (U2.C2)
D/CX(SCL): TopLevel (R74.2 TP26.1), DisplayIface (J1.37)
DB0: TopLevel (R91.1), DisplayIface (18 pins)
DCDC_VS_3.3: TopLevel (C82.2 R120.2 R121.2), Micro (U3.83)
DE: TopLevel (R90.2), DisplayIface (J1.11 J1.12 J1.13 J1.14)
DISPL_CS: TopLevel (TP22.1), Micro (U3.29), DisplayIface (J1.38)
DOUT_N: TopLevel (J6.2), USBIface (FL1.D1 R39.2)
DOUT_P: TopLevel (J6.3), USBIface (FL1.C1 R38.2)
DQ0: Micro (U3.36), FLASH (U2.D3)
DQ1: Micro (U3.35), FLASH (U2.D2)
DQ3/~{HOLD}: Micro (U3.31), FLASH (P2.2 U2.D4)
EN: TopLevel (R82.1), Power (R5.1 R26.1)
EXT_PWR_ON: Micro (U3.97), Power (EXT_PWR_ON.1 Q9.3 R46.1)
EXT_PWR_ON_Z: TopLevel (J3.9), Micro (U3.53)
FAN_CTL1: TopLevel (J2.3), Micro (U3.87)
FAN_CTL2: TopLevel (J2.4), Micro (U3.88)
FLASH_D2: Micro (U3.32), FLASH (P3.1 U2.C4)
GPIO1: TopLevel (IO1.1), Micro (U3.37)
GPIO2: TopLevel (IO2.1), Micro (U3.91)
GPIO3: TopLevel (IO3.1), Micro (U3.95)
GPIO4: TopLevel (IO4.1), Micro (U3.96)
GPIO5: TopLevel (IO5.1), Micro (U3.46)
GPIO6: TopLevel (IO6.1), Micro (U3.45)
GPIO7: TopLevel (IO7.1), Micro (U3.44)
HTR_CTL: TopLevel (J2.1), Micro (U3.86)
I2C1_SCL: TopLevel (L7.2), Micro (U3.92), RTC (IC2.3)
I2C1_SDA: TopLevel (L7.3), Micro (U3.93), RTC (IC2.4)
I_RTD: TopLevel (J5.7 U12.1), U_RTDIface1 (C34_1.2 R30_1.2 U6_1.2)
I_RTD: TopLevel (J5.8 U12.7), U_RTDIface2 (C34_2.2 R30_2.2 U6_2.2)
I_RTD: TopLevel (J5.9 U13.4), U_RTDIface3 (C34_3.2 R30_3.2 U6_3.2)
I_RTD: TopLevel (J5.10 U13.6), U_RTDIface4 (C34_4.2 R30_4.2 U6_4.2)
I_RTD: TopLevel (J5.11 U14.6), U_RTDIface5 (C34_5.2 R30_5.2 U6_5.2)
I_RTD: TopLevel (J5.12 U14.4), U_RTDIface6 (C34_6.2 R30_6.2 U6_6.2)
O_N: TopLevel (L9.1), Audio (C5.2 FB3.2)
O_P: TopLevel (L9.4), Audio (C6.2 FB2.2)
OTG_FLT: Micro (U3.63), USBIface (R66.1)
OTG_PWR_EN: Micro (U3.67), USBIface (R41.1)
OTGOUT: TopLevel (J6.4), USBIface (FL1.A3 R40.2)
PWR_CTL1: TopLevel (R82.2), Micro (U3.55)
PWR_EN: TopLevel (J2.8), Micro (U3.58)
RD: TopLevel (R89.2), DisplayIface (J1.35)
READ: TopLevel (J5.1 U12.4), U_RTDIface1 (C34_1.1 R33_1.1 U6_1.1)
READ: TopLevel (J5.2 U12.6), U_RTDIface2 (C34_2.1 R33_2.1 U6_2.1)
READ: TopLevel (J5.3 U13.1), U_RTDIface3 (C34_3.1 R33_3.1 U6_3.1)
READ: TopLevel (J5.4 U13.7), U_RTDIface4 (C34_4.1 R33_4.1 U6_4.1)
READ: TopLevel (J5.5 U14.7), U_RTDIface5 (C34_5.1 R33_5.1 U6_5.1)
READ: TopLevel (J5.6 U14.1), U_RTDIface6 (C34_6.1 R33_6.1 U6_6.1)
RESET: TopLevel (TP21.1), Micro (U3.64), DisplayIface (J1.10)
RTD1: TopLevel (R83.2 RTD1.1), Micro (U3.25)
RTD2: TopLevel (R84.2 RTD2.1), Micro (U3.26)
RTD3: TopLevel (R85.2 RTD3.1), Micro (U3.33)
RTD4: TopLevel (R86.2 RTD4.1), Micro (U3.34)
RTD5: TopLevel (R87.2 RTD5.1), Micro (U3.15)
RTD6: TopLevel (R88.2 RTD6.1), Micro (U3.16)
SD_MISO: Micro (U3.17), FLASH (J8.7 R128.2)
SD_MOSI: Micro (U3.18 U3.54), FLASH (J8.3 R29.2)
SD_SCK: Micro (U3.52), FLASH (J8.5)
SD_SS: Micro (U3.51), FLASH (J8.2 R129.2)
SDI: TopLevel (R76.2 TP24.1), DisplayIface (J1.34)
SDO: TopLevel (R75.2 TP25.1), DisplayIface (J1.33)
TFT_CLK: TopLevel (R74.1), Micro (U3.78)
TFT_MISO: TopLevel (R75.1), Micro (U3.79)
TFT_MOSI: TopLevel (R76.1), Micro (U3.80)
TFT_WRX: TopLevel (TP27.1), Micro (U3.66), DisplayIface (J1.36)
UART_RX: TopLevel (J9.2), Micro (U3.24)
UART_TX: TopLevel (J9.1), Micro (U3.23)
USB_D_N: Micro (U3.70), USBIface (FL1.D3 R39.1)
USB_D_P: Micro (U3.71), USBIface (FL1.C3 R38.1)
USB_ID: Micro (U3.69), USBIface (R40.1)
VBATT_VS_3.3: TopLevel (C84.2 R124.2 R125.2), Micro (U3.82)
VMAIN_VS_3.3: TopLevel (C83.2 R122.2 R123.2), Micro (U3.81)

## Assembly variants
Default: all parts fitted